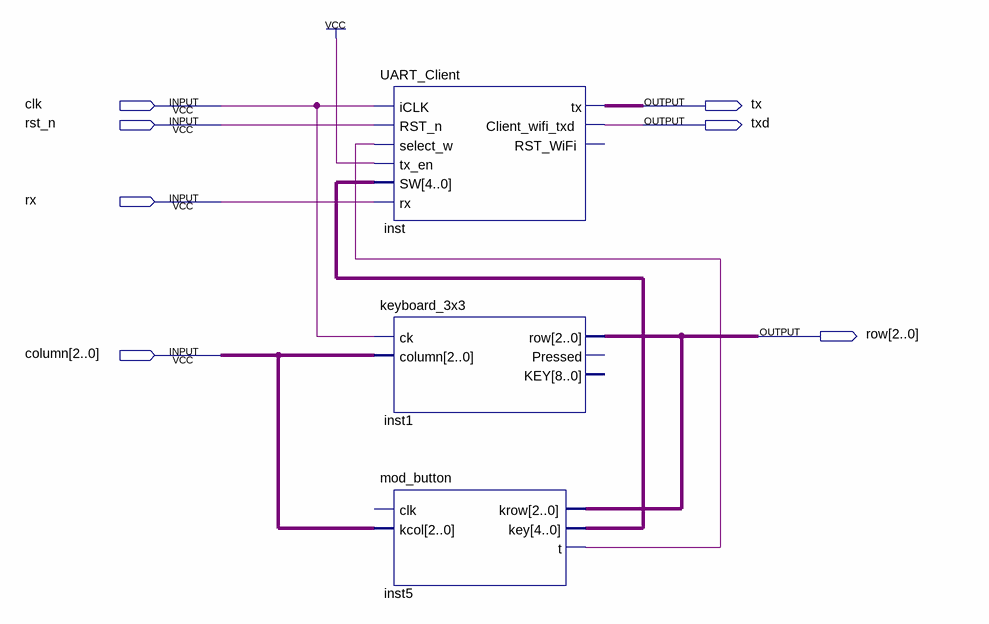
[diagram p0: schematic sheet]
// Quartus schematic top.bdf as structural Verilog: 3 symbols, 7 pins
module top (
  input  clk,
  input  rst_n,
  input  rx,
  input  [2:0] column,
  output tx,
  output txd,
  output [2:0] row
);

  wire inst5_t;
  wire [4:0] inst5_key;

  UART_Client inst (
    .iCLK(clk), .RST_n(rst_n), .select_w(inst5_t), .tx_en(1'b1), .SW(inst5_key), .rx(rx), .tx(tx),
    .Client_wifi_txd(txd));  // open: RST_WiFi
  keyboard_3x3 inst1 (.ck(clk), .column(column), .row(row));  // open: Pressed, KEY
  mod_button inst5 (.kcol(column), .krow(row), .key(inst5_key), .t(inst5_t));  // open: clk
endmodule
